# EAGLE design d_main3 (EAGLE 7.2.0)
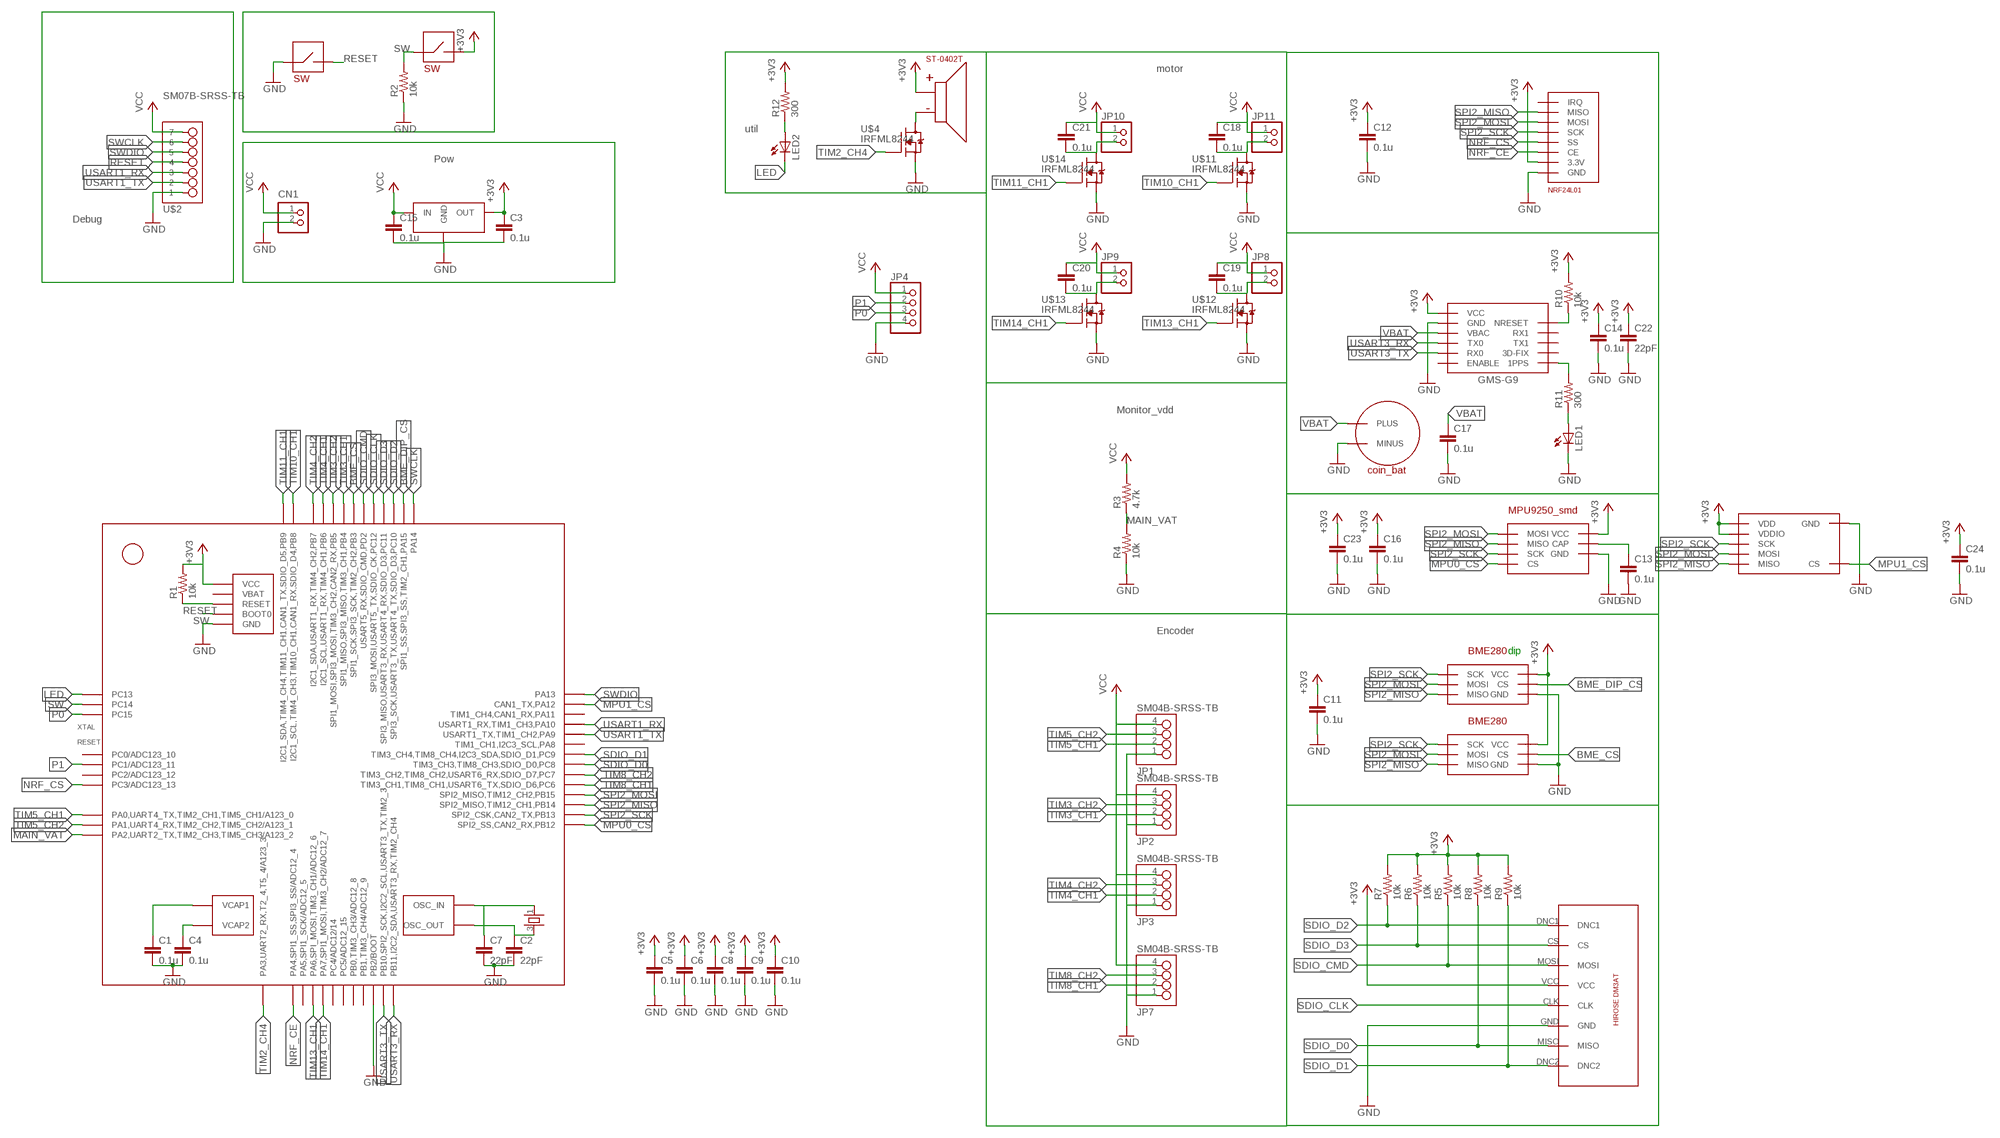
[diagram p0: schematic, sheet 1]

## Parts
C1  0.1u  C-EUC0603K  [C0603K]
C2  22pF  C-EUC0603K  [C0603K]
C3  0.1u  C-EUC0603K  [C0603K]
C4  0.1u  C-EUC0603K  [C0603K]
C5  0.1u  C-EUC0603K  [C0603K]
C6  0.1u  C-EUC0603K  [C0603K]
C7  22pF  C-EUC0603K  [C0603K]
C8  0.1u  C-EUC0603K  [C0603K]
C9  0.1u  C-EUC0603K  [C0603K]
C10  0.1u  C-EUC0603K  [C0603K]
C11  0.1u  C-EUC0603K  [C0603K]
C12  0.1u  C-EUC0603K  [C0603K]
C13  0.1u  C-EUC0603K  [C0603K]
C14  0.1u  C-EUC0603K  [C0603K]
C15  0.1u  C-EUC0603K  [C0603K]
C16  0.1u  C-EUC0603K  [C0603K]
C17  0.1u  C-EUC0603K  [C0603K]
C18  0.1u  C-EUC0603K  [C0603K]
C19  0.1u  C-EUC0603K  [C0603K]
C20  0.1u  C-EUC0603K  [C0603K]
C21  0.1u  C-EUC0603K  [C0603K]
C22  22pF  C-EUC0603K  [C0603K]
C23  0.1u  C-EUC0603K  [C0603K]
C24  0.1u  C-EUC0603K  [C0603K]
CN1  S2B-XASK-1  [S2B-XASK-1]
JP1  SM04B-SRSS-TB  [SM04B-SRSS-TB]
JP2  SM04B-SRSS-TB  [SM04B-SRSS-TB]
JP3  SM04B-SRSS-TB  [SM04B-SRSS-TB]
JP4  PINHD-1X4  [1X04]
JP7  SM04B-SRSS-TB  [SM04B-SRSS-TB]
JP8  PINHD-1X2  [1X02]
JP9  PINHD-1X2  [1X02]
JP10  PINHD-1X2  [1X02]
JP11  PINHD-1X2  [1X02]
LED1  LEDCHIP-LED0603  [CHIP-LED0603]
LED2  LEDCHIP-LED0603  [CHIP-LED0603]
R1  10k  R-US_R0603  [R0603]
R2  10k  R-US_R0603  [R0603]
R3  4.7k  R-US_R0603  [R0603]
R4  10k  R-US_R0603  [R0603]
R5  10k  R-US_R0603  [R0603]
R6  10k  R-US_R0603  [R0603]
R7  10k  R-US_R0603  [R0603]
R8  10k  R-US_R0603  [R0603]
R9  10k  R-US_R0603  [R0603]
R10  10k  R-US_R0603  [R0603]
R11  300  R-US_R0603  [R0603]
R12  300  R-US_R0603  [R0603]
STM32F405RGT6  STM32F405_T  [LQFP64]
U$1  GMS-G9  [GMS-G9]
U$2  SM07B-SRSS-TB  [SM07B-SRSS-TB]
U$3  NRF24L01  [NRF24L01]
U$4  IRFML8244  [SOT23]
U$5  DM3AT  [DM3AT]
U$6  SWTVBP06-B043CB-B  [SW]
U$7  SWTVBP06-B043CB-B  [SW]
U$8  AP7361-33E  [SOT223]
U$9  25MHz  ASF_T  [ASF]
U$10  36-3030-ND  [36-3030-ND]
U$11  IRFML8244  [SOT23]
U$12  IRFML8244  [SOT23]
U$13  IRFML8244  [SOT23]
U$14  IRFML8244  [SOT23]
U$15  MPU9250  [MPU9250_DIP]
U$16  MPU9250_SMD  [MPU9250_SMD]
U$17  BME280  [BME280]
U$18  ST-0402T  [ST-0402T]
U$19  BME280_DIP  [BME280_DIP]

## Nets
+3V3: C3.1 C5.1 C6.1 C8.1 C9.1 C10.1 C11.1 C12.1 C14.1 C16.1 C22.1 C23.1 C24.1 R1.2 R5.2 R6.2 R7.2 R8.2 R9.2 R10.2 R12.2 STM32F405RGT6.13(VCC) STM32F405RGT6.19(VCC) STM32F405RGT6.32(VCC) STM32F405RGT6.48(VCC) STM32F405RGT6.64(VCC) U$1.VCC U$3.3.3V U$5.VCC U$7.P$2 U$8.OUT U$15.VDD U$15.VDDIO U$16.RESV(VCC) U$16.VDD(VCC) U$16.VDDIO(VCC) U$17.VDD(VCC) U$17.VDDIO(VCC) U$18.PLUS U$19.VCC
BME_CS: STM32F405RGT6.55(SPI1_SCK,SPI3_SCK,TIM2_CH2,PB3) U$17.CS
BME_DIP_CS: STM32F405RGT6.50(SPI1_SS,SPI3_SS,TIM2_CH1,PA15) U$19.CS
GND: C1.2 C2.2 C3.2 C4.2 C5.2 C6.2 C7.2 C8.2 C9.2 C10.2 C11.2 C12.2 C13.2 C14.2 C15.2 C16.2 C17.2 C22.2 C23.2 C24.2 CN1.2 JP1.1 JP2.1 JP3.1 JP4.4 JP7.1 LED1.C R2.1 R4.1 STM32F405RGT6.12(GND) STM32F405RGT6.18(GND) STM32F405RGT6.28(PB2/BOOT) STM32F405RGT6.63(GND) U$1.GND U$1.GND1(GND) U$2.P$1 U$3.GND U$4.2(S) U$5.GND U$6.P$1 U$8.GND1(GND) U$8.GND2(GND) U$10.MINUS U$11.2(S) U$12.2(S) U$13.2(S) U$14.2(S) U$15.GND U$16.GND U$16.~RESV(GND) U$17.GND U$17.GND1(GND) U$19.GND
LED: LED2.C STM32F405RGT6.2(PC13)
MAIN_VAT: R3.1 R4.2 STM32F405RGT6.16(PA2,UART2_TX,TIM2_CH3,TIM5_CH3/A123_2)
MPU0_CS: STM32F405RGT6.33(SPI2_SS,CAN2_RX,PB12) U$16.CS
MPU1_CS: STM32F405RGT6.45(CAN1_TX,PA12) U$15.CS
N$5: C4.1 STM32F405RGT6.47(VCAP2)
N$6: C1.1 STM32F405RGT6.31(VCAP1)
N$7: C7.1 STM32F405RGT6.5(OSC_IN) U$9.1
N$8: C2.1 STM32F405RGT6.6(OSC_OUT) U$9.3
N$10: R10.1 U$1.NRESET
N$11: R11.2 U$1.1PPS
N$12: LED1.A R11.1
N$16: LED2.A R12.1
N$17: C18.2 JP11.2 U$11.3(D)
N$18: C19.2 JP8.2 U$12.3(D)
N$19: C20.2 JP9.2 U$13.3(D)
N$20: C21.2 JP10.2 U$14.3(D)
N$23: C13.1 U$16.REGOUT(CAP)
N$25: U$4.3(D) U$18.MINUS
NRF_CE: STM32F405RGT6.20(PA4,SPI1_SS,SPI3_SS/ADC12_4) U$3.CE
NRF_CS: STM32F405RGT6.11(PC3/ADC123_13) U$3.SS
P0: JP4.3 STM32F405RGT6.4(PC15)
P1: JP4.2 STM32F405RGT6.9(PC1/ADC123_11)
RESET: R1.1 STM32F405RGT6.7(RESET) U$2.P$4 U$6.P$2
SDIO_CLK: STM32F405RGT6.53(SPI3_MOSI,USART5_TX,SDIO_CK,PC12) U$5.CLK
SDIO_CMD: R5.1 STM32F405RGT6.54(USART5_RX,SDIO_CMD,PD2) U$5.MOSI
SDIO_D0: R8.1 STM32F405RGT6.39(TIM3_CH3,TIM8_CH3,SDIO_D0,PC8) U$5.MISO
SDIO_D1: R9.1 STM32F405RGT6.40(TIM3_CH4,TIM8_CH4,I2C3_SDA,SDIO_D1,PC9) U$5.DNC2
SDIO_D2: R7.1 STM32F405RGT6.51(SPI3_SCK,USART3_TX,USART4_TX,SDIO_D3,PC10) U$5.DNC1
SDIO_D3: R6.1 STM32F405RGT6.52(SPI3_MISO,USART3_RX,USART4_RX,SDIO_D3,PC11) U$5.CS
SPI2_MISO: STM32F405RGT6.35(SPI2_MISO,TIM12_CH1,PB14) U$3.MISO U$15.MISO U$16.MISO U$17.MISO U$19.MISO
SPI2_MOSI: STM32F405RGT6.36(SPI2_MISO,TIM12_CH2,PB15) U$3.MOSI U$15.MOSI U$16.MOSI U$17.MOSI U$19.MOSI
SPI2_SCK: STM32F405RGT6.34(SPI2_CSK,CAN2_TX,PB13) U$3.SCK U$15.SCL(SCK) U$16.SCK U$17.SCK U$19.SCK
SW: R2.2 STM32F405RGT6.3(PC14) STM32F405RGT6.60(BOOT0) U$7.P$1
SWCLK: STM32F405RGT6.49(PA14) U$2.P$6
SWDIO: STM32F405RGT6.46(PA13) U$2.P$5
TIM2_CH4: STM32F405RGT6.17(PA3,UART2_RX,T2_4,T5_4/A123_3) U$4.1(G)
TIM3_CH1: JP2.2 STM32F405RGT6.56(SPI1_MISO,SPI3_MISO,TIM3_CH1,PB4)
TIM3_CH2: JP2.3 STM32F405RGT6.57(SPI1_MOSI,SPI3_MOSI,TIM3_CH2,CAN2_RX,PB5)
TIM4_CH1: JP3.2 STM32F405RGT6.58(I2C1_SCL,USART1_RX,TIM4_CH1,PB6)
TIM4_CH2: JP3.3 STM32F405RGT6.59(I2C1_SDA,USART1_RX,TIM4_CH2,PB7)
TIM5_CH1: JP1.2 STM32F405RGT6.14(PA0,UART4_TX,TIM2_CH1,TIM5_CH1/A123_0)
TIM5_CH2: JP1.3 STM32F405RGT6.15(PA1,UART4_RX,TIM2_CH2,TIM5_CH2/A123_1)
TIM8_CH1: JP7.2 STM32F405RGT6.37(TIM3_CH1,TIM8_CH1,USART6_TX,SDIO_D6,PC6)
TIM8_CH2: JP7.3 STM32F405RGT6.38(TIM3_CH2,TIM8_CH2,USART6_RX,SDIO_D7,PC7)
TIM10_CH1: STM32F405RGT6.61(I2C1_SCL,TIM4_CH3,TIM10_CH1,CAN1_RX,SDIO_D4,PB8) U$11.1(G)
TIM11_CH1: STM32F405RGT6.62(I2C1_SDA,TIM4_CH4,TIM11_CH1,CAN1_TX,SDIO_D5,PB9) U$14.1(G)
TIM13_CH1: STM32F405RGT6.22(PA6,SPI_MOSI,TIM3_CH1/ADC12_6) U$12.1(G)
TIM14_CH1: STM32F405RGT6.23(PA7,SPI1_MOSI,TIM3_CH2/ADC12_7) U$13.1(G)
USART1_RX: STM32F405RGT6.43(USART1_RX,TIM1_CH3,PA10) U$2.P$3
USART1_TX: STM32F405RGT6.42(USART1_TX,TIM1_CH2,PA9) U$2.P$2
USART3_RX: STM32F405RGT6.30(PB11,I2C2_SDA,USART3_RX,TIM2_CH4) U$1.TX0
USART3_TX: STM32F405RGT6.29(PB10,SPI2_SCK,I2C2_SCL,USART3_TX,TIM2_3) U$1.RX0
VBAT: C17.1 U$1.VBAC U$10.PLUS1(PLUS) U$10.PLUS2(PLUS)
VCC: C15.1 C18.1 C19.1 C20.1 C21.1 CN1.1 JP1.4 JP2.4 JP3.4 JP4.1 JP7.4 JP8.1 JP9.1 JP10.1 JP11.1 R3.2 U$2.P$7 U$8.IN
Unconnected: STM32F405RGT6.1(VBAT) STM32F405RGT6.8(PC0/ADC123_10) STM32F405RGT6.10(PC2/ADC123_12) STM32F405RGT6.21(PA5,SPI1_SCK/ADC12_5) STM32F405RGT6.24(PC4/ADC12/14) STM32F405RGT6.25(PC5/ADC12_15) STM32F405RGT6.26(PB0,TIM3_CH3/ADC12_8) STM32F405RGT6.27(PB1,TIM3_CH4/ADC12_9) STM32F405RGT6.41(TIM1_CH1,I2C3_SCL,PA8) STM32F405RGT6.44(TIM1_CH4,CAN1_RX,PA11) U$1.3D-FIX U$1.ENABLE U$1.RX1 U$1.TX1 U$3.IRQ

## Notes on the sheet
- motor
- util
- Pow
- Debug
- Monitor_vdd
- Encoder
- dip

## Library data of the parts
C1-C24 = resistor:C-EU: CAPACITOR, European symbol
CN1 = jst-xa:S2B-XASK-1: Wire-to-Board 2.5mm pitch top mount connector Source: http://www.jst-mfg.com/product/pdf/jpn/XA1.pdf http://www.jst-mfg.com/product/detail.php?series=272
JP1-JP3 JP7 = con-jst-sh:SM04B-SRSS-TB
JP4 = pinhead:PINHD-1X4: PIN HEADER
JP8-JP11 = pinhead:PINHD-1X2: PIN HEADER
LED1 LED2 = led:LED: LED OSRAM: - CHIPLED LG R971, LG N971, LY N971, LG Q971, LY Q971, LO R971, LY R971 LH N974, LH R974 LS Q976, LO Q976, LY Q976 LO Q996 - Hyper CHIPLED LW Q18S LB Q993, LB Q99A, LB R99A - SideLED LS A670, LO A670, LY A670, LG A670, LP A670 LB A673, LV A673, LT A673, LW A673 LH A674 LY A675 LS A676, LA A676, LO A676, LY A676, LW A676 LS A679, LY A679, LG A679 - Hyper Micro SIDELED® LS Y876, LA Y876, LO Y876, LY Y876 LT Y87S - SmartLED LW L88C, LW L88S LB L89C, LB L89S, LG L890 LS L89K, LO L89K, LY L89K LS L896, LA L896, LO L896, LY L896 - TOPLED LS T670, LO T670, LY T670, LG T670, LP T670 LSG T670, LSP T670, LSY T670, LOP T670, LYG T670 LG T671, LOG T671, LSG T671 LB T673, LV T673, LT T673, LW T673 LH T674 LS T676, LA T676, LO T676, LY T676, LB T676, LH T676, LSB T676, LW T676 LB T67C, LV T67C, LT T67C, LS T67K, LO T67K, LY T67K, LW E67C LS E67B, LA E67B, LO E67B, LY E67B, LB E67C, LV E67C, LT E67C LW T67C LS T679, LY T679, LG T679 LS T770, LO T770, LY T770, LG T770, LP T770 LB T773, LV T773, LT T773, LW T773 LH T774 LS E675, LA E675, LY E675, LS T675 LS T776, LA T776, LO T776, LY T776, LB T776 LHGB T686 LT T68C, LB T68C - Hyper Mini TOPLED® LB M676 - Mini TOPLED Santana® LG M470 LS M47K, LO M47K, LY M47K Source: http://www.osram.convergy.de LUXEON: - LUMILED® LXK2-PW12-R00, LXK2-PW12-S00, LXK2-PW14-U00, LXK2-PW14-V00 LXK2-PM12-R00, LXK2-PM12-S00, LXK2-PM14-U00 LXK2-PE12-Q00, LXK2-PE12-R00, LXK2-PE12-S00, LXK2-PE14-T00, LXK2-PE14-U00 LXK2-PB12-K00, LXK2-PB12-L00, LXK2-PB12-M00, LXK2-PB14-N00, LXK2-PB14-P00, LXK2-PB14-Q00 LXK2-PR12-L00, LXK2-PR12-M00, LXK2-PR14-Q00, LXK2-PR14-R00 LXK2-PD12-Q00, LXK2-PD12-R00, LXK2-PD12-S00 LXK2-PH12-R00, LXK2-PH12-S00 LXK2-PL12-P00, LXK2-PL12-Q00, LXK2-PL12-R00 Source: www.luxeon.com KINGBRIGHT: KA-3528ASYC Source: www.kingbright.com
R1-R12 = resistor:R-US_: RESISTOR, American symbol
STM32F405RGT6 = stm32f:STM32F405_T
U$1 = GMS-G9:GMS-G9
U$2 = con-jst-sh:SM07B-SRSS-TB
U$3 = T-NRF24L01:NRF24L01
U$4 U$11-U$14 = transistor-fet:IRFML8244
U$5 = HIROSE-DM3AT:DM3AT
U$6 U$7 = TVBP06-B043CB-B:SW
U$8 = AP7361-33E:AP7361-33E
U$9 = crystal:ASF_T
U$10 = 36-3030-ND:36-3030-ND
U$15 = MPU9250:MPU9250
U$16 = MPU9250:MPU9250_SMD
U$17 = BME280:BME280
U$18 = ST-0402T:ST-0402T
U$19 = BME280:BME280_DIP

## Board
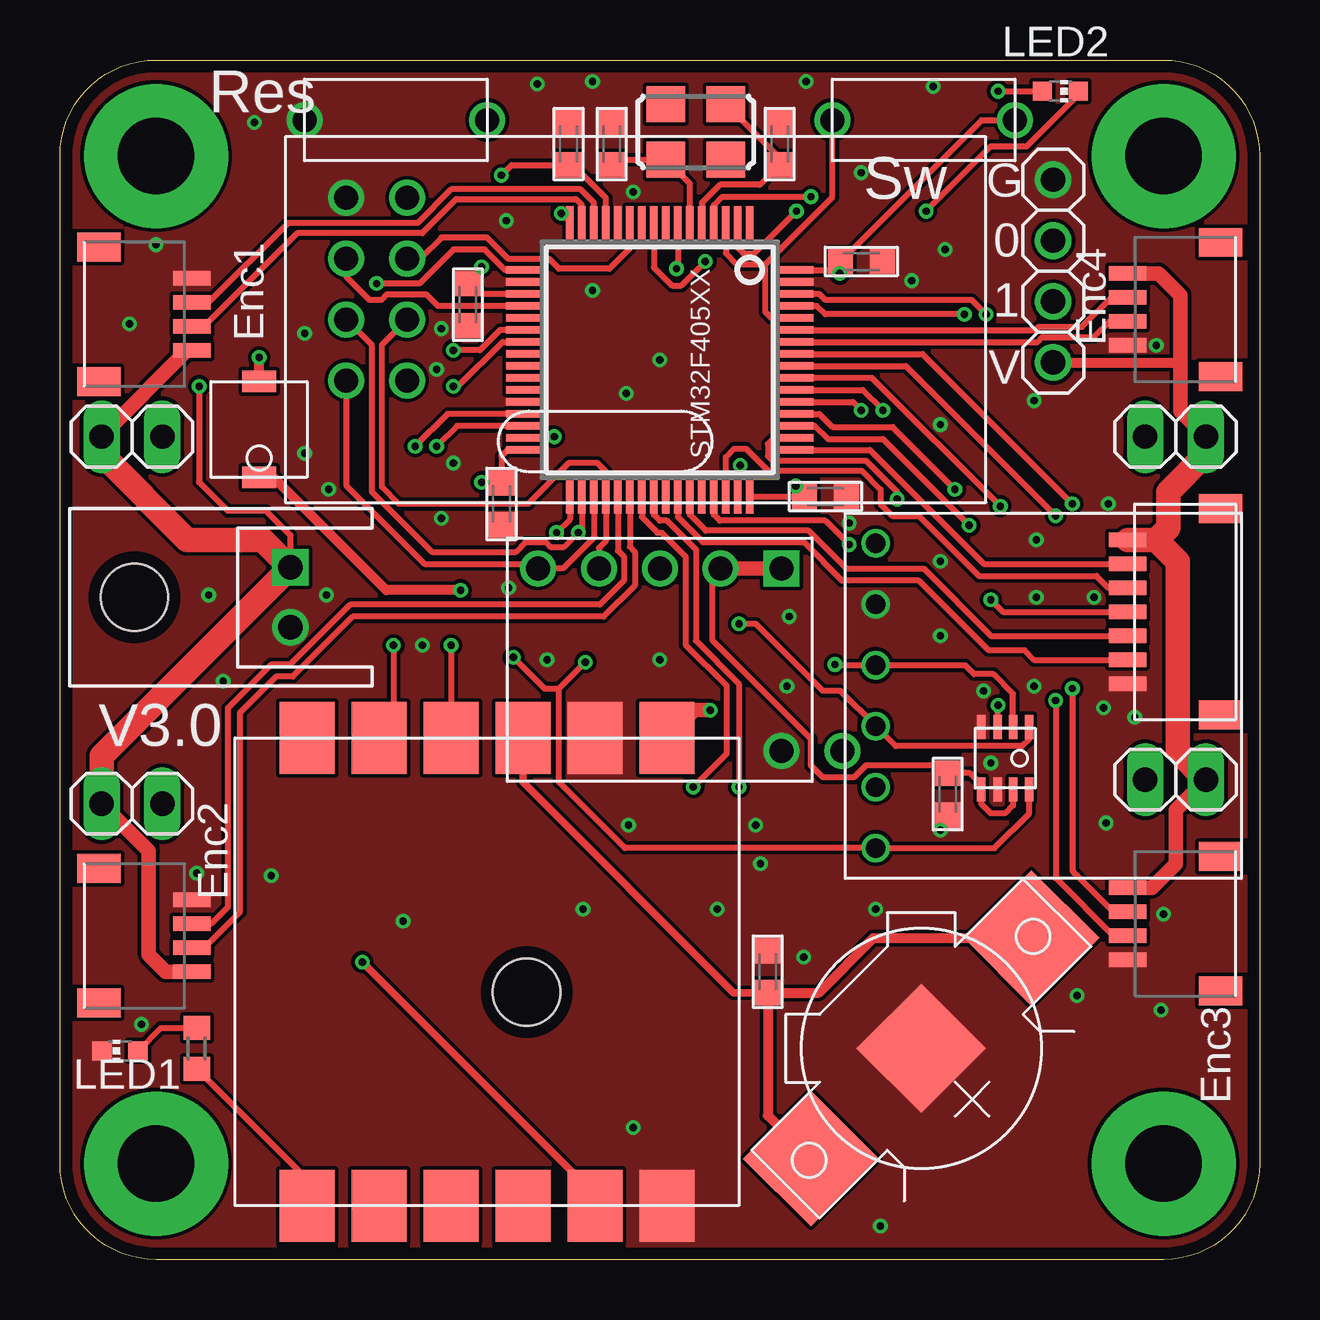
[diagram p1: board, top side]
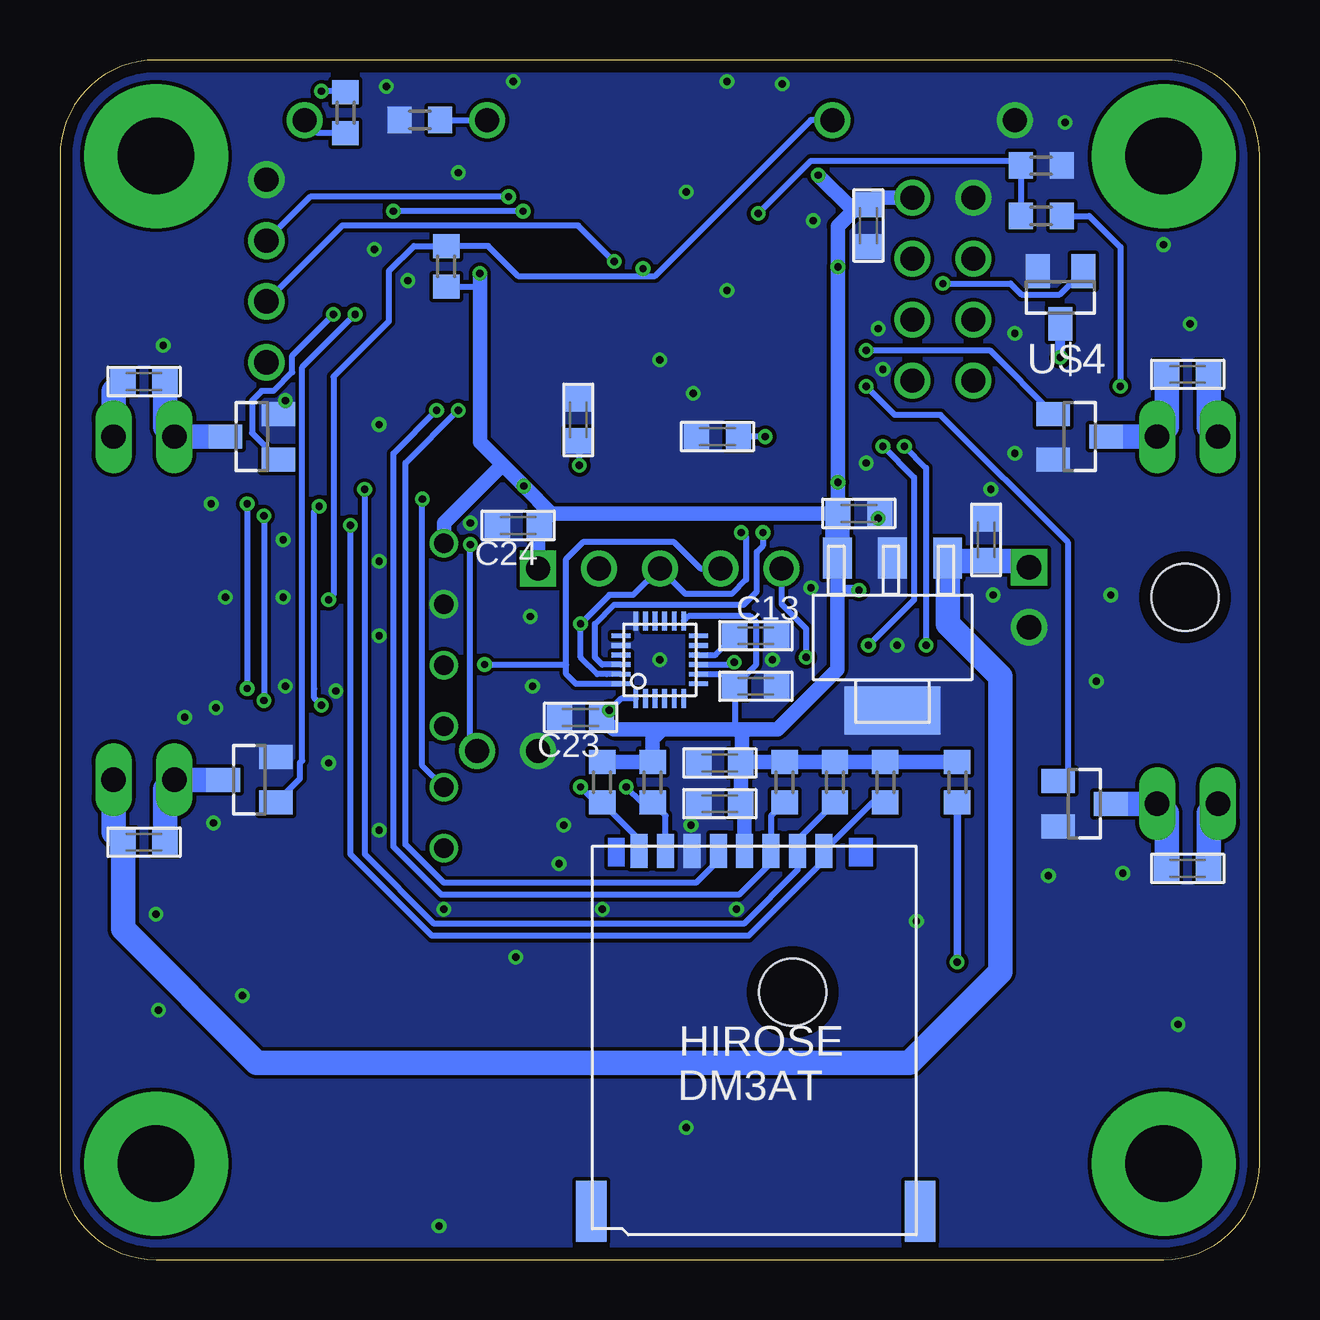
[diagram p2: board, bottom side, seen from below]

Size 50 x 50 mm. Coordinates in mm from the lower left corner, seen from the top.
Outline: 4,0 arc-90 0,4 0,46 arc-90 4,50 46,50 arc-90 50,46 50,4 arc-90 46,0 4,0
Copper layers (1*16): Top 0.035mm / dielectric 1.6mm / Bottom 0.035mm
Design rules "Elecrow_2-layer_PCB_eagle_rule": minimum track width 6mil, minimum drill 12mil, track to track 6mil, track to pad 6mil, pad to pad 6mil, via to via 8mil, smd to smd 0mil, copper to edge 20mil, drill to drill 10mil, minimum pad ring 6mil, minimum via ring 6mil, stop-mask expansion 0mil, vias tented up to drill 100mil, thermal gap 10mil

### Footprints (pad centres in the part's own frame; a part is rotated, then mirrored left to right if it is on the bottom)
C0603K = smd 1.05 x 1.08: 1 -0.875,0; 2 0.875,0
S2B-XASK-1 = drill 1.016 square: 1 1.25,0 | drill 1.016: 2 -1.25,0 | hole 2.8: 0,6.5
SM04B-SRSS-TB = smd 0.6 x 1.55: 1 -1.5,0; 2 -0.5,0; 3 0.5,0; 4 1.5,0 | smd 1.2 x 1.8: P-MOUNT1 -2.8,-3.875; P-MOUNT2 2.8,-3.875
1X04 = drill 1.016: 1 -3.81,0; 2 -1.27,0; 3 1.27,0; 4 3.81,0
1X02 = drill 1.016 long: 1 -1.27,0; 2 1.27,0
CHIP-LED0603 = smd 0.8 x 0.8: A 0,-0.75; C 0,0.75
R0603 = smd 1 x 1.1: 1 -0.85,0; 2 0.85,0
LQFP64 = smd 1.6 x 0.3: 1 -5.6,3.75; 2 -5.6,3.25; 3 -5.6,2.75; 4 -5.6,2.25; 5 -5.6,1.75; 6 -5.6,1.25; 7 -5.6,0.75; 8 -5.6,0.25; 9 -5.6,-0.25; 10 -5.6,-0.75; 11 -5.6,-1.25; 12 -5.6,-1.75; 13 -5.6,-2.25; 14 -5.6,-2.75; 15 -5.6,-3.25; 16 -5.6,-3.75; 33 5.6,-3.75; 34 5.6,-3.25; 35 5.6,-2.75; 36 5.6,-2.25; 37 5.6,-1.75; 38 5.6,-1.25; 39 5.6,-0.75; 40 5.6,-0.25; 41 5.6,0.25; 42 5.6,0.75; 43 5.6,1.25; 44 5.6,1.75; 45 5.6,2.25; 46 5.6,2.75; 47 5.6,3.25; 48 5.6,3.75 | smd 0.3 x 1.6: 17 -3.75,-5.6; 18 -3.25,-5.6; 19 -2.75,-5.6; 20 -2.25,-5.6; 21 -1.75,-5.6; 22 -1.25,-5.6; 23 -0.75,-5.6; 24 -0.25,-5.6; 25 0.25,-5.6; 26 0.75,-5.6; 27 1.25,-5.6; 28 1.75,-5.6; 29 2.25,-5.6; 30 2.75,-5.6; 31 3.25,-5.6; 32 3.75,-5.6; 49 3.75,5.6; 50 3.25,5.6; 51 2.75,5.6; 52 2.25,5.6; 53 1.75,5.6; 54 1.25,5.6; 55 0.75,5.6; 56 0.25,5.6; 57 -0.25,5.6; 58 -0.75,5.6; 59 -1.25,5.6; 60 -1.75,5.6; 61 -2.25,5.6; 62 -2.75,5.6; 63 -3.25,5.6; 64 -3.75,5.6
GMS-G9 = smd 3 x 2.3: 1PPS 9.75,-6; 3D-FIX 9.75,-3; ENABLE -9.75,-6; GND -9.75,6; GND1 9.75,9; NRESET 9.75,6; RX0 -9.75,-3; RX1 9.75,3; TX0 -9.75,0; TX1 9.75,0; VBAC -9.75,3; VCC -9.75,9 | hole 2.8: 0.85,3.15
SM07B-SRSS-TB = smd 0.6 x 1.55: P$1 -3,0; P$2 -2,0; P$3 -1,0; P$4 0,0; P$5 1,0; P$6 2,0; P$7 3,0 | smd 1.2 x 1.8: P$8 -4.3,-3.875; P$9 4.3,-3.875
NRF24L01 = drill 1: 3.3V 24.13,2.54; CE 26.67,5.08; GND 26.67,2.54; IRQ 24.13,10.16; MISO 26.67,10.16; MOSI 24.13,7.62; SCK 26.67,7.62; SS 24.13,5.08
SOT23 = smd 1 x 1.4: 1 -0.95,-1.1; 2 0.95,-1.1; 3 0,1.1
DM3AT = smd 0.711 x 1.422: CLK -1.56,6.63; CS 1.74,6.63; DNC1 2.84,6.63; DNC2 -4.86,6.63; GND -2.66,6.63; MISO -3.76,6.63; MOSI 0.64,6.63; VCC -0.46,6.63 | smd 1.27 x 2.54: P$1 6.85,-8.39; P$2 -6.85,-8.39
SW = drill 1: P$1 -3.81,0; P$2 3.81,0
SOT223 = smd 4 x 2: GND1 0,3.81 | smd 1.2 x 1.7: GND2 0,-2.54; IN -2.3,-2.54; OUT 2.3,-2.54
ASF = smd 1.6 x 1.5: 1 -1.25,-1.15; 2 1.25,-1.15; 3 1.25,1.15; 4 -1.25,1.15
36-3030-ND = smd 3.81 x 3.81: MINUS 0,0 | smd 4 x 4: PLUS1 -6.5,0; PLUS2 6.5,0
MPU9250_DIP = drill 1: CS 3.81,7.62; GND 3.81,5.08; MISO -3.81,-5.08; MOSI -3.81,-2.54; SCL -3.81,0; VDDIO -3.81,2.54 | drill 1 square: VDD -3.81,5.08
MPU9250_SMD = smd 0.2 x 0.8: AUX_CL -1,-1.62; AUX_DA 0.2,1.62; CS -0.2,1.62; FSYNC 0.6,-1.62; INT 1,-1.62; MISO -0.2,-1.62; MOSI -1,1.62; NC9 1,1.62; REGOUT 0.2,-1.62; SCK -0.6,1.62; VDDIO -0.6,-1.62; ~RESV 0.6,1.62 | smd 0.8 x 0.2: GND 1.62,1; NC0 -1.62,0.6; NC1 -1.62,0.2; NC2 -1.62,-0.2; NC3 -1.62,-0.6; NC4 -1.62,-1; NC5 1.62,-0.6; NC6 1.62,-0.2; NC7 1.62,0.2; NC8 1.62,0.6; RESV -1.62,1; VDD 1.62,-1
BME280 = smd 1 x 0.35: CS 1.3,0.325; GND 1.3,1; GND1 -1.3,0.325; MISO -1.3,-1; MOSI 1.3,-0.325; SCK 1.3,-1; VDD -1.3,1; VDDIO -1.3,-0.325
ST-0402T = smd 0.9 x 1.422: MINUS 2,0; PLUS -2,0
BME280_DIP = drill 0.8: CS 0,-3.81; GND 0,3.81; MISO 0,-6.35; MOSI 0,1.27; SCK 0,-1.27; VCC 0,6.35

### Placement (x,y rotation side)
C1  22.6,34.3 180 bottom
C2  23,46.5 90 top
C3  16.7,31.1 0 bottom
C4  28.4,35 90 bottom
C5  17,39.8 270 top
C6  21.2,46.5 90 top
C7  30,46.5 90 top
C8  18.4,31.5 270 top
C9  31.9,31.8 0 top
C10  33.4,41.6 0 top
C11  37,19.4 270 top
C12  16.3,43.1 270 bottom
C13  21,26 0 bottom
C14  22.5,20.7 180 bottom
C15  11.4,30 90 bottom
C16  21,23.9 0 bottom
C17  29.5,12 90 top
C18  46.5,17.4 0 bottom
C19  3,36.9 180 bottom
C20  3,16.3 180 bottom
C21  46.5,36.6 0 bottom
C22  22.5,19 180 bottom
C23  28.3,22.6 180 bottom
C24  30.9,30.6 180 bottom
CN1  9.6,27.6 90 top
JP1  5.5,39.4 270 top
JP2  44.5,14 90 top
JP3  44.5,39.6 90 top
JP4  41.4,41.2 90 top
JP7  5.5,13.5 270 top
JP8  3,34.3 0 top
JP9  3,19 0 top
JP10  46.5,34.3 180 top
JP11  46.5,20 180 top
LED1  2.5,8.7 90 top
LED2  41.7,48.7 270 top
R1  33.9,41.4 270 bottom
R2  35,47.5 0 bottom
R3  9.1,43.5 0 bottom
R4  9.1,45.6 180 bottom
R5  19.8,19.9 90 bottom
R6  17.7,19.9 90 bottom
R7  15.6,19.9 90 bottom
R8  25.3,19.9 90 bottom
R9  27.4,19.9 90 bottom
R10  12.6,19.9 90 bottom
R11  5.7,8.8 270 top
R12  38.1,47.8 270 bottom
STM32F405RGT6  25,37.5 270 top
U$1  16.3,12 270 top
U$2  44.5,27 90 top
U$3  38.6,46.8 180 top
U$4  8.3,40.1 180 bottom
U$5  21,10.4 0 bottom
U$6  14,47.5 0 top
U$7  36,47.5 0 top
U$8  15.3,26.7 180 bottom
U$9  26.5,47 180 top
U$10  35.9,8.8 225 top
U$11  42.1,20 90 bottom
U$12  7.5,34.3 270 bottom
U$13  7.3,19 270 bottom
U$14  42,34.3 90 bottom
U$15  25,25 270 top
U$16  25,25 90 bottom
U$17  39.4,20.9 90 top
U$18  8.3,34.6 90 top
U$19  34,23.5 0 top

### Tracks (layer width: path | path; a pad name or v marks a point on that pad's centre or on a via)
+3V3  (via drill 0.3)
  Top 0.254: STM32F405RGT6.32 18.65,33.75 18.4,33.5 C8.1 17.6,32.38 v17.57,32.4 | STM32F405RGT6.48 28.85,31.8 C9.1 30.66,32.16 v30.66,32.24 | U$17.VDDIO 39.73,18.93 39.4,18.6 38.8,18.6 38.4,19 U$17.VDD 38.4,19.8 37.92,20.27 C11.1 36.67,20.6 33.6,20.6 33.1,20.1 31.8,20.1 31.3,20.6 31.3,21.7 27.2,25.8 27.2,28.47 U$15.VDDIO | U$7.P$2 38.42,47.5 C10.1 32.17,41.25 STM32F405RGT6.64 | STM32F405RGT6.19 17.62,40.25 17.2,40.67 C5.1 17.57,41.25 v17.57,41.38 | STM32F405RGT6.13 22.75,44.25 21.38,45.62 C6.1 18.82,45.62 v18.4,45.2 | v32.5,41.1 32.5,41.58
  Top 0.406: v16.7,27.9 13.6,27.9 8.9,32.6 U$18.PLUS
  Top 0.61: v27.1,22.9 26.45,22.9 U$1.VCC | U$15.VDD U$15.VDDIO | 32.5,41.58 C10.1
  Bottom 0.24: C16.1 21.88,22.27 21.7,22.1 | U$16.VDDIO 22.38,24.4 C16.1 | U$16.RESV 26.62,23.38 v27.1,22.9 | C16.1 21,24.77 21,26.6 21.22,26.82 23.8,26.82 U$16.VDD
  Bottom 0.254: R12.2 39.26,46.95 U$7.P$2 | R1.2 32.55,40.55 32.5,40.5
  Bottom 0.406: v16.7,27.9 17.6,27.9
  Bottom 0.61: U$8.OUT 17.6,27.9 17.6,24.6 20.1,22.1 21.7,22.1 | U$5.VCC 21.46,18.84 C22.1 C14.1 21.57,20.75 | R9.2 R8.2 25.3,21.7 24.9,22.1 | 21.57,20.75 21.57,21.98 21.7,22.1 | 21.57,20.75 R5.2 R6.2 R7.2 R10.2 | 24.9,22.1 26.9,22.1 27.4,22.6 C23.1 27.12,22.9 v27.1,22.9 | 24.9,22.1 21.7,22.1 | 29.52,31.1 C3.1 v17.57,32.4 v17.57,41.38 17.57,43.08 16.88,43.77 | U$15.VDD 30.08,30.55 C24.1 29.52,31.1 | 16.88,43.77 16.68,43.98 C12.1 16.02,44.26 U$3.3.3V | 31.56,33.14 v30.66,32.24 29.52,31.1 | U$19.VCC 34,30.7 31.56,33.14 | 31.56,33.14 32.5,34.08 32.5,40.5 v32.5,41.1 | v18.4,45.2 16.98,43.77 16.88,43.77
  Bottom 1.016: U$8.OUT 17.6,31.08 C3.1
BME_CS  (via drill 0.3)
  Top 0.24: U$17.CS 39.1,22.23 | STM32F405RGT6.55 33.85,36.75 v39.2,31.4
  Top 0.254: 39.1,22.23 v39.1,23.1
  Bottom 0.24: 39.4,23.8 39.4,31.2 v39.2,31.4
  Bottom 0.254: v39.1,23.1 39.4,23.4 39.4,23.8
BME_DIP_CS  (via drill 0.3)
  Top 0.254: STM32F405RGT6.50 29.75,34.25 29.5,34 29.5,33.5 29.7,33.3 33.6,33.3 34.9,32 v34.9,31.7
  Bottom 0.254: U$19.CS 34.9,20.59 v34.9,31.7
GND  (via drill 0.3)
  other vias: 43.6,18.2 21.8,14.6 36.7,26 34,14.6 36.7,17.9 25,25 4,42.3 23.6,36.1 40.7,27.6 30.3,23.9 20.3,25 15.9,30.9 23.7,18.1 30.4,26.8 45.7,38.1 10.2,33.6 11.2,32.1 40.6,35.8 15.9,38.8 25,37.5 23.9,44.5 29,18.1 29.2,16.5 38.5,23.7 6.2,27.7 6.8,24.1 11.1,27.7 5.7,16.1 8.8,16 23.9,5.5 34.2,1.4 27.4,14.6 32.9,30.7 2.9,39 8.1,47.4 19.9,49 22.2,49.1 31.1,49.1 22.2,40.4 16.4,33.2 15.7,37.1 3.4,9.8 15.1,25.6 31,12.6 38.8,20.7 40.6,23.9 45.9,10.4 46,14.4 43.5,23 44.8,22.6 43.7,31.5 42.4,11 14.3,14.1 36.9,42.1 33.4,45.3 36.4,48.9 18.7,28 10.2,38.6 43.1,27.6 18.6,43.3 35.5,40.8 40.7,30 36.7,34.8 36.7,29.1
  pour Bottom (rank 6, no thermals): -5,55 55,55 55,-5 -5,-5
  pour Top (rank 6, no thermals): -3,53 53,53 53,-3 -3,-3
LED  (via drill 0.3)
  Top 0.254: STM32F405RGT6.2 28.25,42.17 28.5,41.92 28.92,41.92 v30.7,43.7 | v36.1,43.7 38.8,46.4 40.3,46.4 42.45,48.55 LED2.C
  Bottom 0.254: v30.7,43.7 v36.1,43.7
MAIN_VAT  (via drill 0.3)
  Top 0.254: STM32F405RGT6.16 21.25,43.25 v20.9,43.6
  Bottom 0.254: R3.1 R4.2 10.15,45.8 18.7,45.8 v20.9,43.6
MPU0_CS  (via drill 0.3)
  Top 0.254: STM32F405RGT6.33 21.25,30.85 v20.7,30.3
  Bottom 0.24: U$16.CS 27.4,24.8 27.7,25.1 27.7,26.5 26.9,27.3 21.5,27.3 20.95,27.85 20.95,29.5 20.7,29.75 v20.7,30.3
MPU1_CS  (via drill 0.3)
  Top 0.254: STM32F405RGT6.45 27.25,31.05 27.5,30.8 31.9,30.8 v32.9,29.8
  Bottom 0.254: U$15.CS 32.9,21.47 v32.9,29.8
N$1  (via drill 3.2 pad 6)
  other vias: 4,4
N$2  (via drill 3.2 pad 6)
  other vias: 4,46
N$3  (via drill 3.2 pad 6)
  other vias: 46,46
N$4  (via drill 3.2 pad 6)
  other vias: 46,4
N$5  (via drill 0.3)
  Top 0.254: STM32F405RGT6.47 28.25,33 v28.35,33.1
  Bottom 0.254: v28.35,33.1 28.35,34.08 C4.1
N$6  (via drill 0.3)
  Top 0.254: STM32F405RGT6.31 20.55,34.25 v20.6,34.3
  Bottom 0.254: v20.6,34.3 C1.1
N$7
  Top 0.254: STM32F405RGT6.5 26.75,44.05 27.5,44.8 29.17,44.8 C7.1 30,45.9 U$9.1
N$8
  Top 0.254: STM32F405RGT6.6 26.25,44.85 U$9.3 23.23,45.85 C2.1
N$10  (via drill 0.3)
  Top 0.305: U$1.NRESET 22.3,2.7 v12.6,12.4
  Bottom 0.305: v12.6,12.4 R10.1
N$11
  Top 0.254: R11.2 10.3,3.35 U$1.1PPS
N$12
  Top 0.254: LED1.A 4.2,9.65 R11.1
N$16  (via drill 0.3)
  Top 0.254: v39.1,48.7 LED2.A
  Bottom 0.254: R12.1 38.15,48.7 v39.1,48.7
N$17
  Bottom 1.016: C18.2 45.62,19.61 JP11.2 U$11.3
N$18
  Bottom 1.016: C19.2 3.88,34.7 JP8.2 U$12.3
N$19
  Bottom 1.016: C20.2 3.88,18.61 JP9.2 U$13.3
N$20
  Bottom 1.016: C21.2 45.62,34.7 JP10.2 U$14.3
N$23
  Bottom 0.24: U$16.REGOUT 22.68,25.2 C13.1
N$25  (via drill 0.3)
  Top 0.406: U$18.MINUS v8.3,37.6
  Bottom 0.406: v8.3,37.6 U$4.3
NRF_CE
  Top 0.254: STM32F405RGT6.20 15.75,39.75 15.28,40.22 13.62,40.22 13.4,40 12.9,40 11.93,40.97 U$3.CE
NRF_CS
  Top 0.254: STM32F405RGT6.11 23.75,42.15 22.9,41.3 20.8,41.3 20.4,41.7 18.7,41.7 17.8,42.6 15.9,42.6 15.02,41.72 U$3.SS
P0  (via drill 0.3)
  Top 0.254: STM32F405RGT6.4 27.25,43.95 27.6,44.3 v31.3,44.3
  Bottom 0.254: v31.3,44.3 39.57,44.3 JP4.3
P1  (via drill 0.3)
  Top 0.254: STM32F405RGT6.9 24.75,41.35 25.5,40.6 25.9,40.6 v26.9,41.6
  Bottom 0.254: v26.9,41.6 28.4,43.1 38.23,43.1 JP4.2
RESET  (via drill 0.3)
  Top 0.254: STM32F405RGT6.7 25.75,41.35 v25.7,41.3 | v38.8,27.5 39.3,27 U$2.P$4
  Bottom 0.254: U$6.P$2 18.7,47.5 25.2,41 25.7,41 | v38.8,27.5 38.6,27.7 38.6,36.8 36.3,39.1 36.3,41.2 35.25,42.25 R1.1 32.15,42.25 30.9,41 25.7,41 | v25.7,41.3 25.7,41
SDIO_CLK  (via drill 0.3)
  Top 0.254: STM32F405RGT6.53 33.05,35.75 v33.4,35.4
  Bottom 0.254: U$5.CLK 22.56,16.64 23.5,15.7 34,15.7 35.6,17.3 35.6,33.2 v33.4,35.4
SDIO_CMD  (via drill 0.3)
  Top 0.254: STM32F405RGT6.54 33.45,36.25 v34.3,35.4
  Bottom 0.254: R5.1 20.36,18.49 U$5.MOSI 20.36,16.54 21.7,15.2 34.1,15.2 36.1,17.2 36.1,33.6 v34.3,35.4
SDIO_D0  (via drill 0.3)
  Top 0.254: STM32F405RGT6.39 24.25,30.95 24.9,30.3 25.08,30.3 26.08,29.3 26.08,25.62 27.8,23.9 27.8,21.1 v26.4,19.7
  Bottom 0.254: U$5.MISO 24.76,18.51 R8.1 25.75,19.05 v26.4,19.7
SDIO_D1  (via drill 0.3)
  Top 0.254: v28.3,19.7 28.3,24 26.5,25.8 26.5,29.6 25.3,30.8 25,30.8 24.75,31.05 STM32F405RGT6.40
  Bottom 0.254: v28.3,19.7 27.65,19.05 R9.1 25.86,17.51 U$5.DNC2
SDIO_D2  (via drill 0.3)
  Top 0.254: STM32F405RGT6.51 31.45,34.75 32,34.2 34.3,34.2 v37.9,30.6
  Bottom 0.254: U$5.DNC1 18.16,16.54 | U$5.DNC1 18.16,16.64 21.3,13.5 34.5,13.5 37.9,16.9 v37.9,30.6 | U$5.DNC1 16.14,19.05 R7.1
SDIO_D3  (via drill 0.3)
  Top 0.254: STM32F405RGT6.52 31.65,35.25 32.2,34.7 34.7,34.7 v37.3,32.1
  Bottom 0.254: R6.1 19.26,17.49 U$5.CS 19.26,16.24 21.5,14 34.4,14 37.3,16.9 v37.3,32.1
SPI2_MISO  (via drill 0.3)
  Top 0.24: U$17.MISO 40.4,18.6 38.95,17.15 U$19.MISO 23.55,17.15 20.8,19.9
  Top 0.254: STM32F405RGT6.35 22.25,30.1 20.96,28.81 U$15.MISO 19.73,29 15.2,29 11.93,32.27 U$3.MISO | 20.8,19.9 20.8,23.8 | 20.8,23.8 v21.9,24.9 | v18.9,25.1 20.2,23.8 20.8,23.8
  Bottom 0.24: U$16.MISO 22,24.8 v21.9,24.9
  Bottom 0.254: U$15.MISO 19.92,27.32 18.9,26.3 v18.9,25.1
SPI2_MOSI  (via drill 0.3)
  Top 0.24: STM32F405RGT6.36 22.75,29.95 22.46,29.66 U$15.MOSI | U$19.MOSI 32.33,24.77 v32.3,24.8
  Top 0.254: STM32F405RGT6.36 22.75,32.85 22.4,33.2 21.2,33.2 19.5,31.5 14.12,31.5 13.42,32.2 13.42,38.13 U$3.MOSI | U$17.MOSI 39.73,23.57 38.9,24.4 38.1,24.4 37.73,24.77 U$19.MOSI
  Bottom 0.24: U$16.MOSI 28.5,24 28.9,24.4 28.9,24.8 | U$15.MOSI 23.31,28.81 24.4,29.9 28.2,29.9 28.9,29.2 28.9,24.8 | v32.3,24.8 28.9,24.8
SPI2_SCK  (via drill 0.3)
  Top 0.24: 19,29.5 19.4,29.9 20.25,29.9 20.45,29.7 21,29.7 v21.6,30.3
  Top 0.254: 19,29.5 15.5,29.5 13,32 13,38.11 U$3.SCK | U$17.SCK 40.4,21.7 40.1,21.4 34.83,21.4 U$19.SCK 32.53,23.7 31.8,23.7 29,26.5 v28.3,26.5 | STM32F405RGT6.34 21.75,30.45 v21.6,30.3
  Bottom 0.24: U$16.SCK 27.2,24.4 | 27.6,24.4 28.3,25.1 v28.3,26.5 27.1,27.7 26.11,27.7 U$15.SCL 23.93,27.74 22,27.74 21.4,28.34 21.4,30.1 v21.6,30.3
  Bottom 0.254: 27.2,24.4 27.6,24.4
SW
  Top 0.254: STM32F405RGT6.60 29.65,39.25 29.4,39.5 29.4,41.5 | 29.4,41.5 32.19,44.29 U$7.P$1 | STM32F405RGT6.3 27.75,41.95 28.2,41.5 29.4,41.5
  Bottom 0.254: R2.2 U$7.P$1
SWCLK
  Top 0.254: STM32F405RGT6.49 33.75,33.75 38.5,29 U$2.P$6
SWDIO
  Top 0.254: STM32F405RGT6.46 27.75,33.45 28.1,33.8 28.6,33.8 29.52,32.88 33.42,32.88 34.2,32.1 34.2,31.5 34.7,31 35.8,31 38.3,28.5 43.2,28.5 43.7,28 U$2.P$5
TIM2_CH4  (via drill 0.3)
  Top 0.254: STM32F405RGT6.17 18.55,41.25 17.7,42.1 16.4,42.1 14.98,40.68 v13.2,40.68
  Bottom 0.254: U$4.1 8.33,40.22 9.92,40.22 10.38,40.68 v13.2,40.68
TIM3_CH1  (via drill 0.3)
  Top 0.254: STM32F405RGT6.56 35.25,37.25 v41.5,31 | v41.5,23.3 41.5,15.9 43.9,13.5 JP2.2
  Bottom 0.254: v41.5,31 v41.5,23.3
TIM3_CH2  (via drill 0.3)
  Top 0.254: STM32F405RGT6.57 35.95,37.75 v42.2,31.5 | v42.2,23.8 42.2,16.2 43.9,14.5 JP2.3
  Bottom 0.254: v42.2,31.5 v42.2,23.8
TIM4_CH1
  Top 0.254: STM32F405RGT6.58 40.75,38.25 40.95,38.45 43.1,38.45 43.75,39.1 JP3.2
TIM4_CH2
  Top 0.254: STM32F405RGT6.59 40.67,38.75 40.8,38.88 42.6,38.88 43.82,40.1 JP3.3
TIM5_CH1
  Top 0.254: STM32F405RGT6.14 22.25,44.06 21.7,44.61 16.31,44.61 14.9,43.2 9.5,43.2 6.2,39.9 JP1.2
TIM5_CH2
  Top 0.254: STM32F405RGT6.15 21.75,43.95 21.5,44.2 16.52,44.2 15.1,42.78 9.88,42.78 6,38.9 JP1.3
TIM8_CH1
  Top 0.254: STM32F405RGT6.37 23.25,29.55 23.5,29.3 23.5,28.3 22.5,27.3 12.1,27.3 9.6,24.8 8.8,24.8 7,23 7,14.7 6.3,14 JP7.2
TIM8_CH2
  Top 0.254: STM32F405RGT6.38 23.75,29.71 23.96,29.5 23.96,28.1 22.66,26.8 12.2,26.8 9.7,24.3 9,24.3 7.5,22.8 7.5,14.5 6,13 JP7.3 5.9,13
TIM10_CH1  (via drill 0.3)
  Top 0.254: v37.7,39.4 31.9,39.4 31.55,39.75 STM32F405RGT6.61
  Bottom 0.254: U$11.1 40,20.05 40,20.7 39.9,20.8 39.9,37.2 v37.7,39.4
TIM11_CH1  (via drill 0.3)
  Top 0.254: v38.6,39.4 38,40 31.9,40 31.65,40.25 STM32F405RGT6.62
  Bottom 0.254: U$14.1 42,34.45 42,35.8 41.6,36.2 41.1,36.2 40.32,36.98 40.32,37.68 v38.6,39.4
TIM13_CH1  (via drill 0.3)
  Top 0.254: STM32F405RGT6.22 18.35,38.75 17.5,37.9 v16.4,37.9
  Bottom 0.254: v16.4,37.9 11.25,37.9 U$12.1
TIM14_CH1  (via drill 0.3)
  Top 0.254: v16.4,36.4 16.6,36.4 18.45,38.25 STM32F405RGT6.23
  Bottom 0.254: v16.4,36.4 15.2,35.2 13.3,35.2 8,29.9 8,20.35 U$13.1
USART1_RX
  Top 0.254: U$2.P$3 38.8,26 36,28.8 32.78,28.8 31.2,30.38 26.92,30.38 26.25,31.05 STM32F405RGT6.43
USART1_TX
  Top 0.254: STM32F405RGT6.42 25.75,30.95 26.8,29.9 31,29.9 32.6,28.3 35.8,28.3 38.7,25.4 40.2,25.4 40.6,25 U$2.P$2
USART3_RX  (via drill 0.3)
  Top 0.254: STM32F405RGT6.30 16.55,34.75 v15.7,33.9 | v16.3,25.6 U$1.TX0
  Bottom 0.254: v15.7,33.9 14.4,32.6 14.4,27.5 v16.3,25.6
USART3_TX  (via drill 0.3)
  Top 0.254: STM32F405RGT6.29 16.15,35.25 v14.8,33.9 | v13.9,25.6 13.9,22.35 U$1.RX0
  Bottom 0.254: v14.8,33.9 13.9,33 v13.9,25.6
VBAT
  Top 0.305: U$1.VBAC 19.3,19.9 28.08,11.12 C17.1
  Top 0.406: U$10.PLUS2 29.5,6.01 C17.1 31.62,11.12 33.9,13.4 U$10.PLUS1
VCC  (via drill 0.3)
  Top 0.254: CN1.1 9.6,30.2 8.6,31.2 7,31.2 5.8,32.4 v5.8,36.4
  Top 0.406: JP4.1 46.69,37.39 46.7,37.4
  Top 0.61: JP1.4 5.3,37.9 1.73,34.33 JP8.1 | JP7.4 4.4,12 3.7,12.7 3.7,17.03 JP9.1 | JP3.4 45.8,41.1 46.7,40.2 46.7,37.4 46.7,35.37 JP10.1 | JP2.4 45.5,15.5 46.5,16.5 46.5,18.73 JP11.1
  Top 1.016: JP8.1 1.73,33.57 5.3,30 8.45,30 CN1.1 1.73,20.98 JP9.1 | U$2.P$7 45.7,30 | 45.7,30 46.6,29.1 46.6,21.17 JP11.1 | JP10.1 47.77,33.57 46.2,32 46.2,30.5 45.7,30
  Bottom 0.254: R3.2 7.1,43.5 5.8,42.2 v5.8,36.4
  Bottom 1.016: CN1.1 9.88,29.12 C15.1 12.89,29.12 U$8.IN 13,26.5 10.8,24.3 10.8,12 14.6,8.2 41.8,8.2 47.38,13.77 C18.1 47.77,17.8 JP11.1 | C19.1 2.12,34.7 JP8.1 | JP9.1 2.12,18.61 C20.1 | JP10.1 47.77,36.2 C21.1

### Text on the board
tPlace: G | 0 | 1 | V
tNames: Res | Sw | Enc1 | Enc4 | V3.0 | Enc2 | Enc3